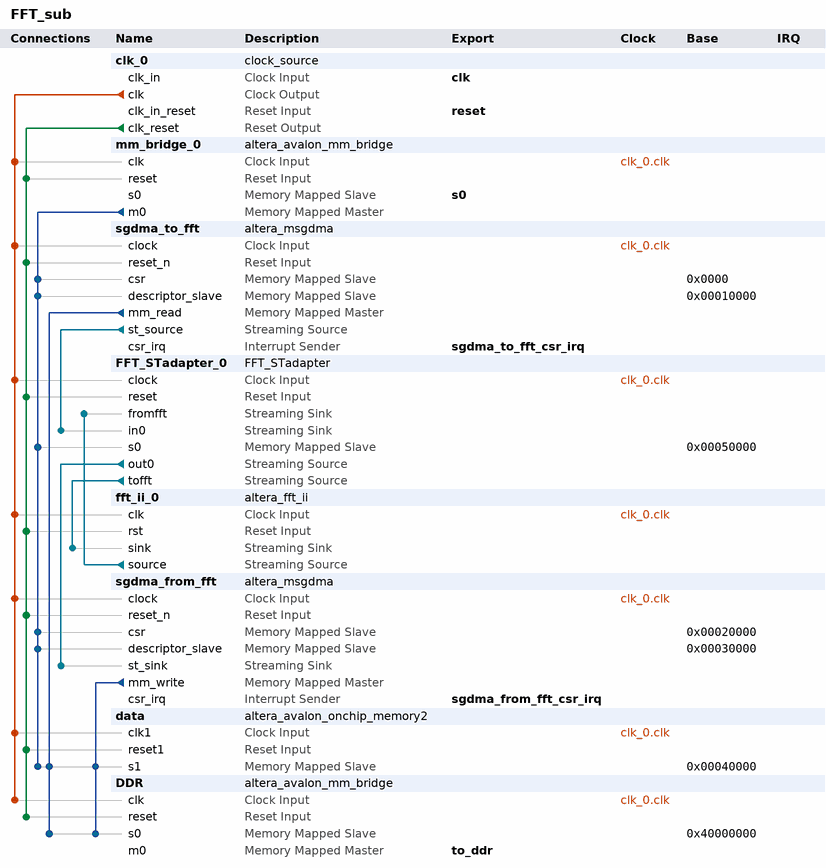
[diagram p0: system contents]
# Platform Designer (Qsys) system FFT_sub, Cyclone V 5CSEMA5F31C6
# Parameters at their usual value, and those the tool derives, are not listed.
package require -exact qsys 16.1
create_system FFT_sub
set_project_property DEVICE_FAMILY {Cyclone V}
set_project_property DEVICE 5CSEMA5F31C6

add_instance clk_0 clock_source 16.1
set_instance_parameter_value clk_0 clockFrequency 50000000

add_instance mm_bridge_0 altera_avalon_mm_bridge 16.1
set_instance_parameter_value mm_bridge_0 ADDRESS_UNITS SYMBOLS
set_instance_parameter_value mm_bridge_0 ADDRESS_WIDTH 19
set_instance_parameter_value mm_bridge_0 DATA_WIDTH 32
set_instance_parameter_value mm_bridge_0 MAX_PENDING_RESPONSES 4
set_instance_parameter_value mm_bridge_0 USE_AUTO_ADDRESS_WIDTH 0

add_instance sgdma_to_fft altera_msgdma 16.1
set_instance_parameter_value sgdma_to_fft BURST_ENABLE 0
set_instance_parameter_value sgdma_to_fft DATA_FIFO_DEPTH 128
set_instance_parameter_value sgdma_to_fft DATA_WIDTH 32
set_instance_parameter_value sgdma_to_fft DESCRIPTOR_FIFO_DEPTH 128
set_instance_parameter_value sgdma_to_fft ENHANCED_FEATURES 0
set_instance_parameter_value sgdma_to_fft ERROR_ENABLE 1
set_instance_parameter_value sgdma_to_fft ERROR_WIDTH 2
set_instance_parameter_value sgdma_to_fft MAX_BURST_COUNT 2
set_instance_parameter_value sgdma_to_fft MAX_BYTE 131072
set_instance_parameter_value sgdma_to_fft MODE 1
set_instance_parameter_value sgdma_to_fft PACKET_ENABLE 1
set_instance_parameter_value sgdma_to_fft TRANSFER_TYPE {Aligned Accesses}

add_instance FFT_STadapter_0 FFT_STadapter 1.1
set_instance_parameter_value FFT_STadapter_0 FFT_IN_WIDTH 16
set_instance_parameter_value FFT_STadapter_0 FFT_OUT_WIDTH 24
set_instance_parameter_value FFT_STadapter_0 SIZE_WIDTH 14

add_instance fft_ii_0 altera_fft_ii 16.1
set_instance_parameter_value fft_ii_0 data_flow {Variable Streaming}
set_instance_parameter_value fft_ii_0 data_rep {Fixed Point}
set_instance_parameter_value fft_ii_0 engine_arch {Quad Output}
set_instance_parameter_value fft_ii_0 in_width 16
set_instance_parameter_value fft_ii_0 length 8192
set_instance_parameter_value fft_ii_0 out_order Natural
set_instance_parameter_value fft_ii_0 out_width 24
set_instance_parameter_value fft_ii_0 twid_width 16

add_instance sgdma_from_fft altera_msgdma 16.1
set_instance_parameter_value sgdma_from_fft BURST_ENABLE 0
set_instance_parameter_value sgdma_from_fft DATA_FIFO_DEPTH 128
set_instance_parameter_value sgdma_from_fft DATA_WIDTH 128
set_instance_parameter_value sgdma_from_fft DESCRIPTOR_FIFO_DEPTH 128
set_instance_parameter_value sgdma_from_fft ENHANCED_FEATURES 0
set_instance_parameter_value sgdma_from_fft ERROR_ENABLE 1
set_instance_parameter_value sgdma_from_fft ERROR_WIDTH 2
set_instance_parameter_value sgdma_from_fft MAX_BURST_COUNT 2
set_instance_parameter_value sgdma_from_fft MAX_BYTE 131072
set_instance_parameter_value sgdma_from_fft MODE 2
set_instance_parameter_value sgdma_from_fft PACKET_ENABLE 1
set_instance_parameter_value sgdma_from_fft TRANSFER_TYPE {Aligned Accesses}

add_instance data altera_avalon_onchip_memory2 16.1
set_instance_parameter_value data dataWidth 64
set_instance_parameter_value data dualPort false
set_instance_parameter_value data initMemContent true
set_instance_parameter_value data initializationFileName onchip_mem.hex
set_instance_parameter_value data memorySize 65536

add_instance DDR altera_avalon_mm_bridge 16.1
set_instance_parameter_value DDR ADDRESS_UNITS SYMBOLS
set_instance_parameter_value DDR ADDRESS_WIDTH 30
set_instance_parameter_value DDR DATA_WIDTH 64
set_instance_parameter_value DDR MAX_BURST_SIZE 16
set_instance_parameter_value DDR MAX_PENDING_RESPONSES 4
set_instance_parameter_value DDR USE_AUTO_ADDRESS_WIDTH 0

# connections
add_connection clk_0.clk data.clk1 clock
add_connection clk_0.clk DDR.clk clock
add_connection clk_0.clk fft_ii_0.clk clock
add_connection clk_0.clk FFT_STadapter_0.clock clock
add_connection clk_0.clk mm_bridge_0.clk clock
add_connection clk_0.clk sgdma_from_fft.clock clock
add_connection clk_0.clk sgdma_to_fft.clock clock
add_connection clk_0.clk_reset data.reset1 reset
add_connection clk_0.clk_reset DDR.reset reset
add_connection clk_0.clk_reset fft_ii_0.rst reset
add_connection clk_0.clk_reset FFT_STadapter_0.reset reset
add_connection clk_0.clk_reset mm_bridge_0.reset reset
add_connection clk_0.clk_reset sgdma_from_fft.reset_n reset
add_connection clk_0.clk_reset sgdma_to_fft.reset_n reset
add_connection mm_bridge_0.m0 data.s1 avalon
set_connection_parameter_value mm_bridge_0.m0/data.s1 baseAddress 0x00040000
add_connection mm_bridge_0.m0 FFT_STadapter_0.s0 avalon
set_connection_parameter_value mm_bridge_0.m0/FFT_STadapter_0.s0 baseAddress 0x00050000
add_connection mm_bridge_0.m0 sgdma_from_fft.csr avalon
set_connection_parameter_value mm_bridge_0.m0/sgdma_from_fft.csr baseAddress 0x00020000
add_connection mm_bridge_0.m0 sgdma_from_fft.descriptor_slave avalon
set_connection_parameter_value mm_bridge_0.m0/sgdma_from_fft.descriptor_slave baseAddress 0x00030000
add_connection mm_bridge_0.m0 sgdma_to_fft.csr avalon
set_connection_parameter_value mm_bridge_0.m0/sgdma_to_fft.csr baseAddress 0x0000
add_connection mm_bridge_0.m0 sgdma_to_fft.descriptor_slave avalon
set_connection_parameter_value mm_bridge_0.m0/sgdma_to_fft.descriptor_slave baseAddress 0x00010000
add_connection sgdma_from_fft.mm_write data.s1 avalon
set_connection_parameter_value sgdma_from_fft.mm_write/data.s1 baseAddress 0x00040000
add_connection sgdma_from_fft.mm_write DDR.s0 avalon
set_connection_parameter_value sgdma_from_fft.mm_write/DDR.s0 baseAddress 0x40000000
add_connection sgdma_to_fft.mm_read data.s1 avalon
set_connection_parameter_value sgdma_to_fft.mm_read/data.s1 baseAddress 0x00040000
add_connection sgdma_to_fft.mm_read DDR.s0 avalon
set_connection_parameter_value sgdma_to_fft.mm_read/DDR.s0 baseAddress 0x40000000
add_connection fft_ii_0.source FFT_STadapter_0.fromfft avalon_streaming
add_connection FFT_STadapter_0.out0 sgdma_from_fft.st_sink avalon_streaming
add_connection FFT_STadapter_0.tofft fft_ii_0.sink avalon_streaming
add_connection sgdma_to_fft.st_source FFT_STadapter_0.in0 avalon_streaming

# exported interfaces
add_interface clk clock sink
set_interface_property clk EXPORT_OF clk_0.clk_in
add_interface reset reset sink
set_interface_property reset EXPORT_OF clk_0.clk_in_reset
add_interface s0 avalon slave
set_interface_property s0 EXPORT_OF mm_bridge_0.s0
add_interface sgdma_from_fft_csr_irq interrupt sender
set_interface_property sgdma_from_fft_csr_irq EXPORT_OF sgdma_from_fft.csr_irq
add_interface sgdma_to_fft_csr_irq interrupt sender
set_interface_property sgdma_to_fft_csr_irq EXPORT_OF sgdma_to_fft.csr_irq
add_interface to_ddr avalon master
set_interface_property to_ddr EXPORT_OF DDR.m0

set_interconnect_requirement {$system} qsys_mm.clockCrossingAdapter HANDSHAKE
set_interconnect_requirement {$system} qsys_mm.insertDefaultSlave FALSE
set_interconnect_requirement {$system} qsys_mm.maxAdditionalLatency 0
set_interconnect_requirement hps_only_master.master qsys_mm.security SECURE

save_system FFT_sub.qsys
